# Altium project Tube1.PrjPCB
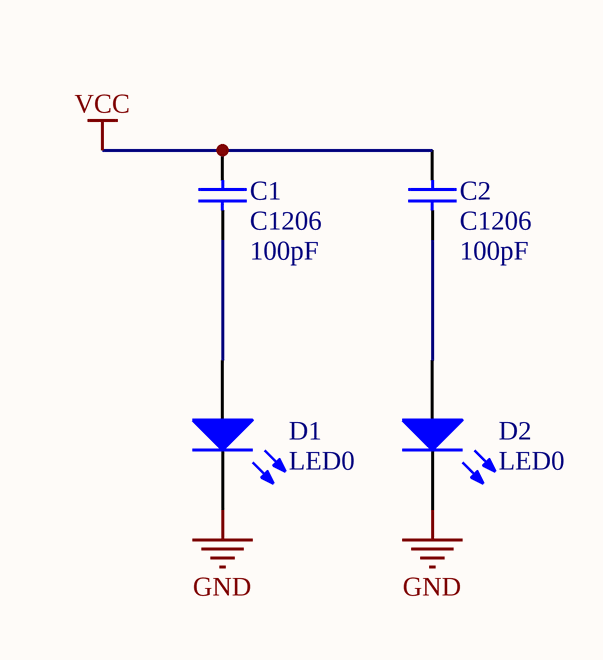
[diagram p0: Sheet1.SchDoc]
5 sheets, 50 parts. Net scope: global (net labels, ports and power ports of the same name join across sheets).
Board file: Tube1.PcbDoc
Sheets:
  Sheet1.SchDoc
  Power.SchDoc
  MCU.SchDoc
  AMP.SchDoc
  Con485.SchDoc

## Sheet Sheet1.SchDoc: The schematic of Tube Board of XDM-1
size A4; Author: ALU; DrawnBy: alu; Engineer: alu; Revision: 1; SheetNumber: 1; SheetTotal: 1; Time: NoTime

### Parts
(Parts that share a designator on the sheet are numbered #1, #2 ... from top to bottom, then left to right.)
C1#1  C1206  value 100pF  [1206]
C2#1  C1206  value 100pF  [1206]
D1#1  LED0  [0805]
D2#1  LED0  [LED-0]

### Nets
GND: D1#1.2(K) D2#1.2(K)
VCC: C1#1.2 C2#1.2
NetC1#1_1: C1#1.1 D1#1.1(A)
NetC2#1_1: C2#1.1 D2#1.1(A)

### Library data of the parts
C1#1 C2#1 = C1206: Ceramic Chip Capacitor - Standard; Published: 17-Jul-2002; LatestRevisionDate: 19-Mar-2004; LatestRevisionNote: Silkscreen size reduced.; DatasheetDocument: Mar-2001; PackageDocument: Mar-2001; PackageReference: 1206; Publisher: Altium Limited; Code_JEITA: 1206; Code_IPC: 3216 [1206]; ComponentLink1Description: Manufacturer Link; ComponentLink1URL: http://www.kemet.com/; ComponentLink2Description: Datasheet; ComponentLink2URL: http://www.kemet.com/kemet/web/homepage/kechome.nsf/vapubfilesname/F3102TA.pdf/$file/F3102TA.pdf
D1#1 D2#1 = LED0: Typical INFRARED GaAs LED; Published: 8-Jun-2000; LatestRevisionDate: 08-Jul-2005; LatestRevisionNote: Mech Layer 1 removed.; PackageReference: LED-0; Publisher: Altium Limited

## Sheet Power.SchDoc
size A4
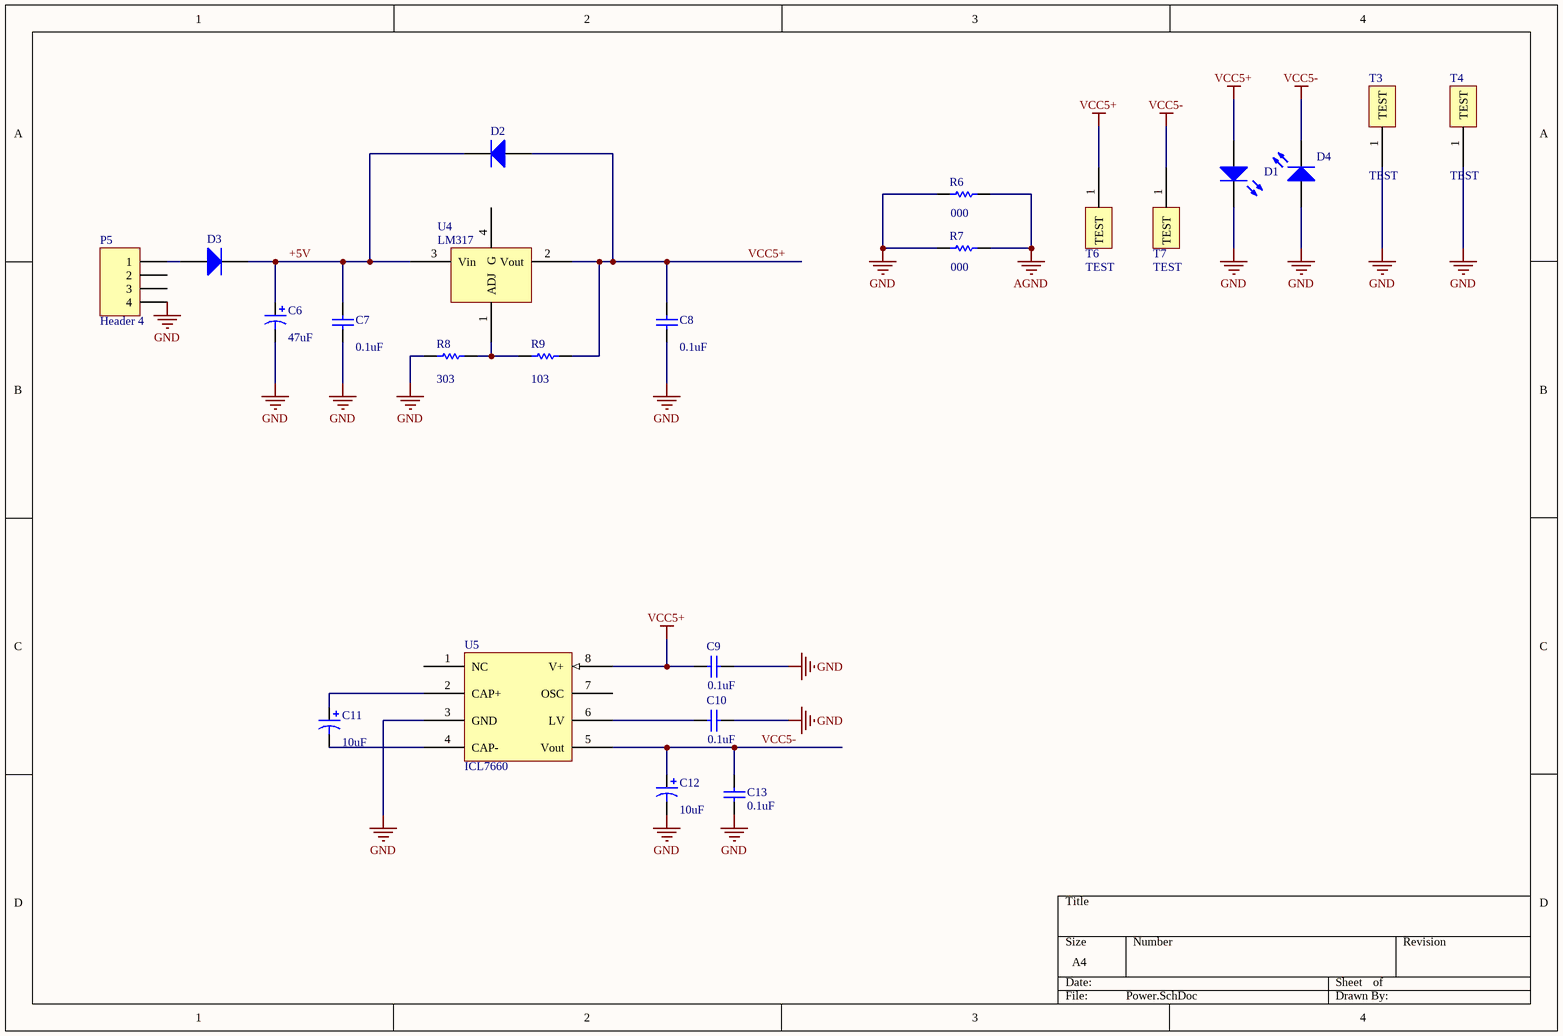
[diagram p1: Power.SchDoc]

### Parts
(Parts that share a designator on the sheet are numbered #1, #2 ... from top to bottom, then left to right.)
C6  value 47uF  [6032]  (hidden comment: Cap Pol3)
C7  value 0.1uF  [1206]  (hidden comment: Cap Semi)
C8  value 0.1uF  [1206]  (hidden comment: Cap Semi)
C9  value 0.1uF  [1206]  (hidden comment: Cap Semi)
C10  value 0.1uF  [1206]  (hidden comment: Cap Semi)
C11  value 10uF  [1206]  (hidden comment: Cap Pol3)
C12  value 10uF  [1206]  (hidden comment: Cap Pol3)
C13  value 0.1uF  [1206]  (hidden comment: Cap Semi)
D1#2  LED2  [0805_LED]  (value not drawn)
D2#2  Diode  [1N5824]  (value not drawn)
D3  Diode  [1N5824]  (value not drawn)
D4  LED2  [0805_LED]  (value not drawn)
P5  Header 4  [HDR1X4]
R6  value 000  [1206]  (hidden comment: Res Semi)
R7  value 000  [0805R]  (hidden comment: Res Semi)
R8  value 303  [1206]  (hidden comment: Res Semi)
R9  value 103  [1206]  (hidden comment: Res Semi)
T3  TEST  [TEST]
T4  TEST  [TEST]
T6  TEST  [TEST_2]
T7  TEST  [TEST_2]
U4  LM317  [SOT223]
U5  ICL7660  [SO8]

### Nets
AGND: R6.2 R7.2
GND: C6.2 C7.1 C8.2 C9.2 C10.2 C12.2 C13.1 D1#2.2(K) D4.1(A) P5.4 R6.1 R7.1 R8.1 T3.1(TEST) T4.1(TEST) U5.3(GND)
VCC5+: C8.1 C9.1 D1#2.1(A) D2#2.1(A) R9.2 T6.1(TEST) U4.2(Vout) U5.8(V+)
VCC5-: C12.1 C13.2 D4.2(K) T7.1(TEST) U5.5(Vout)
+5V: C6.1 C7.2 D2#2.2(K) D3.2(K) U4.3(Vin)
NetC10_1: C10.1 U5.6(LV)
NetC11_1: C11.1 U5.2(CAP+)
NetC11_2: C11.2 U5.4(CAP-)
NetD3_1: D3.1(A) P5.1
NetR8_2: R8.2 R9.1 U4.1(ADJ)

Not connected (* = marked no-connect by the designer): P5 2 3; U4 4(G); U5 1(NC) 7(OSC)

### Library data of the parts
C6 C11 C12 = Cap Pol3: Polarized Capacitor (Surface Mount); Published: 8-Jun-2000; LatestRevisionDate: 29-May-2009; LatestRevisionNote: IPC-7351 Footprint Added.; PackageReference: C0805; Publisher: Altium Limited; PackageDescription: Chip Capacitor
C7-C10 C13 = Cap Semi: Capacitor (Semiconductor SIM Model); Published: 8-Jun-2000; LatestRevisionDate: 29-May-2009; LatestRevisionNote: IPC-7351 Footprint Added.; PackageReference: C1206; Publisher: Altium Limited; PackageDescription: Chip Capacitor
D1#2 D4 = LED2: Typical RED, GREEN, YELLOW, AMBER GaAs LED; Published: 8-Jun-2000; LatestRevisionDate: 17-Jul-2002; LatestRevisionNote: Re-released for DXP Platform.; PackageVersion: Feb-2002; PackageReference: 3.2X1.6X1.1; Publisher: Altium Limited
D2#2 D3 = Diode: Default Diode; Published: 8-Jun-2000; LatestRevisionDate: 17-Jul-2002; LatestRevisionNote: Re-released for DXP Platform.; PackageVersion: Sep-1996; PackageReference: SMC; Publisher: Altium Limited; Code_JEDEC: DO-214-AB
P5 = Header 4: Header, 4-Pin; LatestRevisionDate: 17-Jul-2002; LatestRevisionNote: Re-released for DXP Platform.; Publisher: Altium Limited
R6-R9 = Res Semi: Semiconductor Resistor; Published: 8-Jun-2000; LatestRevisionDate: 17-Jul-2002; LatestRevisionNote: Re-released for DXP Platform.; PackageReference: AXIAL-0.5; Publisher: Altium Limited

## Sheet MCU.SchDoc
size A4
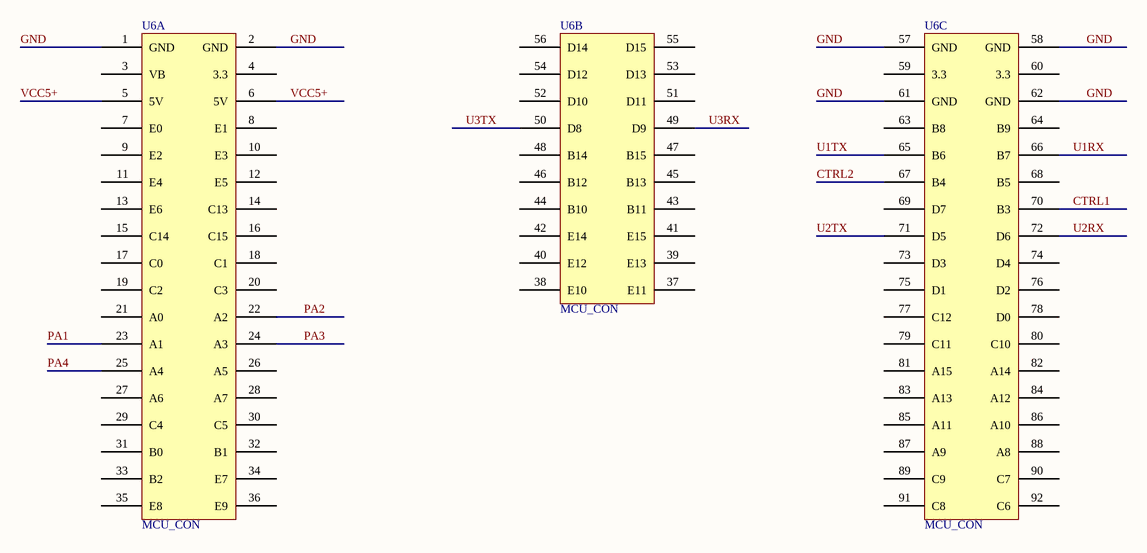
[diagram p2: MCU.SchDoc]

### Parts
U6  MCU_CON  [MCU_CON]  (parts A,B,C of 3)

### Nets
GND: U6.1(GND) U6.2(GND) U6.57(GND) U6.58(GND) U6.61(GND) U6.62(GND)
VCC5+: U6.5(5V) U6.6(5V)
CTRL1: U6.70(B3)
CTRL2: U6.67(B4)
PA1: U6.23(A1)
PA2: U6.22(A2)
PA3: U6.24(A3)
PA4: U6.25(A4)
U1RX: U6.66(B7)
U1TX: U6.65(B6)
U2RX: U6.72(D6)
U2TX: U6.71(D5)
U3RX: U6.49(D9)
U3TX: U6.50(D8)

Not connected (* = marked no-connect by the designer): U6 3(VB) 4(3.3) 7(E0) 8(E1) 9(E2) 10(E3) 11(E4) 12(E5) 13(E6) 14(C13) 15(C14) 16(C15) 17(C0) 18(C1) 19(C2) 20(C3) 21(A0) 26(A5) 27(A6) 28(A7) 29(C4) 30(C5) 31(B0) 32(B1) 33(B2) 34(E7) 35(E8) 36(E9) 37(E11) 38(E10) 39(E13) 40(E12) 41(E15) 42(E14) 43(B11) 44(B10) 45(B13) 46(B12) 47(B15) 48(B14) 51(D11) 52(D10) 53(D13) 54(D12) 55(D15) 56(D14) 59(3.3) 60(3.3) 63(B8) 64(B9) 68(B5) 69(D7) 73(D3) 74(D4) 75(D1) 76(D2) 77(C12) 78(D0) 79(C11) 80(C10) 81(A15) 82(A14) 83(A13) 84(A12) 85(A11) 86(A10) 87(A9) 88(A8) 89(C9) 90(C7) 91(C8) 92(C6)

## Sheet AMP.SchDoc
size A4
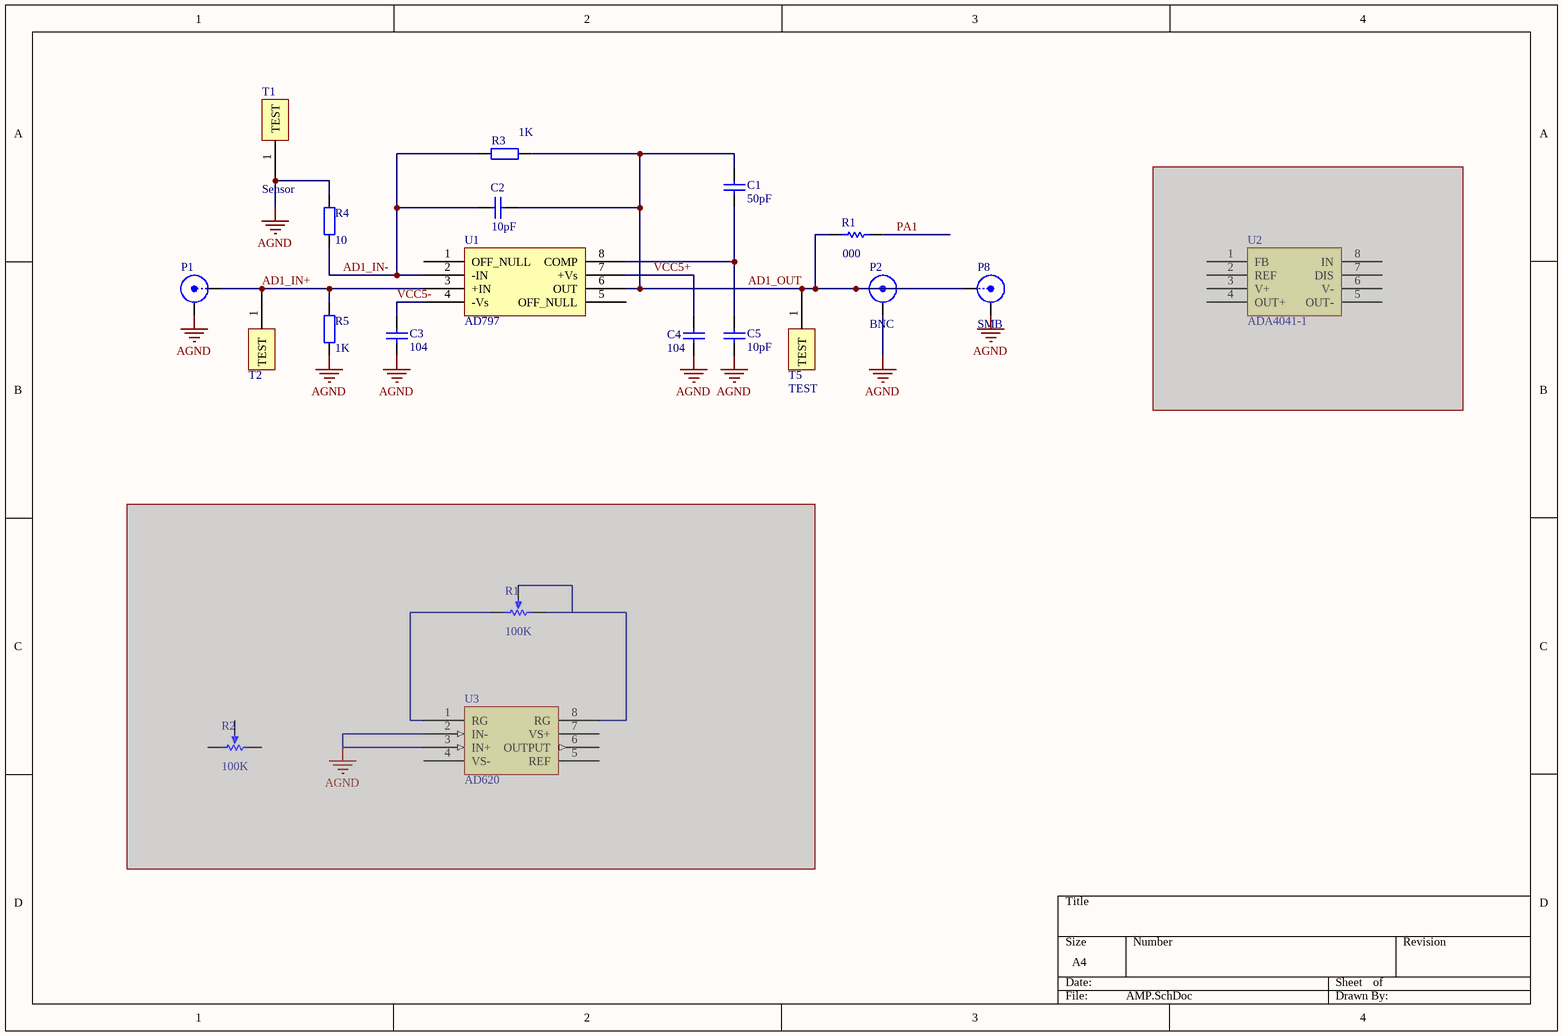
[diagram p3: AMP.SchDoc]

### Parts
(Parts that share a designator on the sheet are numbered #1, #2 ... from top to bottom, then left to right.)
C1#2  value 50pF  [1206]  (hidden comment: Cap)
C2#2  value 10pF  [1206]  (hidden comment: Cap)
C3  value 104  [1206]  (hidden comment: Cap)
C4  value 104  [1206]  (hidden comment: Cap)
C5  value 10pF  [1206]  (hidden comment: Cap)
P1  SMB  [SMB_V-RJ45]  (value not drawn)
P2  BNC  [BNC_RA CON]
P8  SMB  [SMB_V-RJ45]
R1#1  value 000  [1206]  (hidden comment: Res Semi)
R1#2  value 100K  [VR5]  (hidden comment: RPot)  (masked out: inside a compile mask, not in the netlist)
R2  value 100K  [VR5]  (hidden comment: RPot)  (masked out: inside a compile mask, not in the netlist)
R3  value 1K  [1206]  (hidden comment: Res2)
R4  value 10  [1206]  (hidden comment: Res2)
R5  value 1K  [1206]  (hidden comment: Res2)
T1  Sensor  [TEST_2]
T2  Sensor  [TEST_2]  (value not drawn)
T5  TEST  [TEST]
U1  AD797  [SO8]
U2  ADA4041-1  [SO8]  (masked out: inside a compile mask, not in the netlist)
U3  AD620  [SO8]  (masked out: inside a compile mask, not in the netlist)

### Nets
AGND: C3.2 C4.2 C5.2 P1.2(Y) P2.2(Y) P8.2(Y) R4.2 R5.1 T1.1(TEST)
VCC5+: C4.1 U1.7(+Vs)
VCC5-: C3.1 U1.4(-Vs)
AD1_IN+: P1.1(X) R5.2 T2.1(TEST) U1.3(+IN)
AD1_IN-: C2#2.2 R3.2 R4.1 U1.2(-IN)
AD1_OUT: C1#2.1 C2#2.1 P2.1(X) P8.1(X) R1#1.1 R3.1 T5.1(TEST) U1.6(OUT)
PA1: R1#1.2
NetC1#2_2: C1#2.2 C5.1 U1.8(COMP)

Not connected (* = marked no-connect by the designer): U1 1(OFF_NULL) 5(OFF_NULL)

### Library data of the parts
C1#2 C2#2 C3-C5 = Cap: Capacitor; Published: 8-Jun-2000; LatestRevisionDate: 17-Jul-2002; LatestRevisionNote: Re-released for DXP Platform.; PackageReference: RAD-0.3; Publisher: Altium Limited
P1 P8 = SMB: SMB Straight Connector; LatestRevisionDate: 17-Jul-2002; LatestRevisionNote: Re-released for DXP Platform.; Publisher: Altium Limited
P2 = BNC: BNC Elbow Connector; LatestRevisionDate: 17-Jul-2002; LatestRevisionNote: Re-released for DXP Platform.; Publisher: Altium Limited
R1#1 = Res Semi: Semiconductor Resistor; Published: 8-Jun-2000; LatestRevisionDate: 17-Jul-2002; LatestRevisionNote: Re-released for DXP Platform.; PackageReference: AXIAL-0.5; Publisher: Altium Limited
R1#2 R2 = RPot: Potentiometer; Sim Note: Enter the Resistance value and the set point into parameter fields.; Set Position: 0.5; Published: 8-Jun-2000; LatestRevisionDate: 17-Jul-2002; LatestRevisionNote: Re-released for DXP Platform.; PackageReference: VR5; Publisher: Altium Limited
R3-R5 = Res2: Resistor; Published: 8-Jun-2000; LatestRevisionDate: 17-Jul-2002; LatestRevisionNote: Re-released for DXP Platform.; PackageReference: AXIAL-0.4; Publisher: Altium Limited
T1 T2 = TEST

## Sheet Con485.SchDoc
size A4
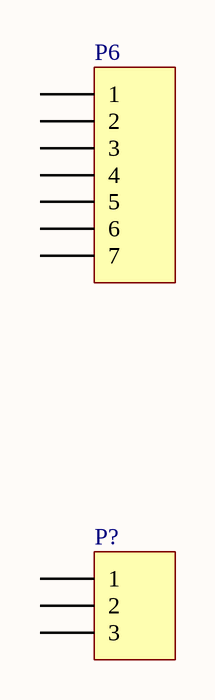
[diagram p4: Con485.SchDoc]

### Parts
P3  Header 3  [HDR1X3]  (value not drawn)
P6  Header 7  [HDR1X7]  (value not drawn)

### Nets

Not connected (* = marked no-connect by the designer): P3 1 2 3; P6 1 2 3 4 5 6 7

### Library data of the parts
P3 = Header 3: Header, 3-Pin
P6 = Header 7: Header, 7-Pin; LatestRevisionDate: 17-Jul-2002; LatestRevisionNote: Re-released for DXP Platform.; Publisher: Altium Limited

## Nets that join several sheets
AGND: Power (R6.2 R7.2), AMP (9 pins)
GND: Sheet1 (D1#1.2 D2#1.2), Power (16 pins), MCU (6 pins)
VCC5+: Power (8 pins), MCU (U6.5 U6.6), AMP (C4.1 U1.7)
VCC5-: Power (5 pins), AMP (C3.1 U1.4)
PA1: MCU (U6.23), AMP (R1#1.2)